# EAGLE design OSO-SAFE-A1-04 (EAGLE 9.4.2)
COMPANY: ADAFRUIT INDUSTRIES; DRAWN: KTOWN; REV: B
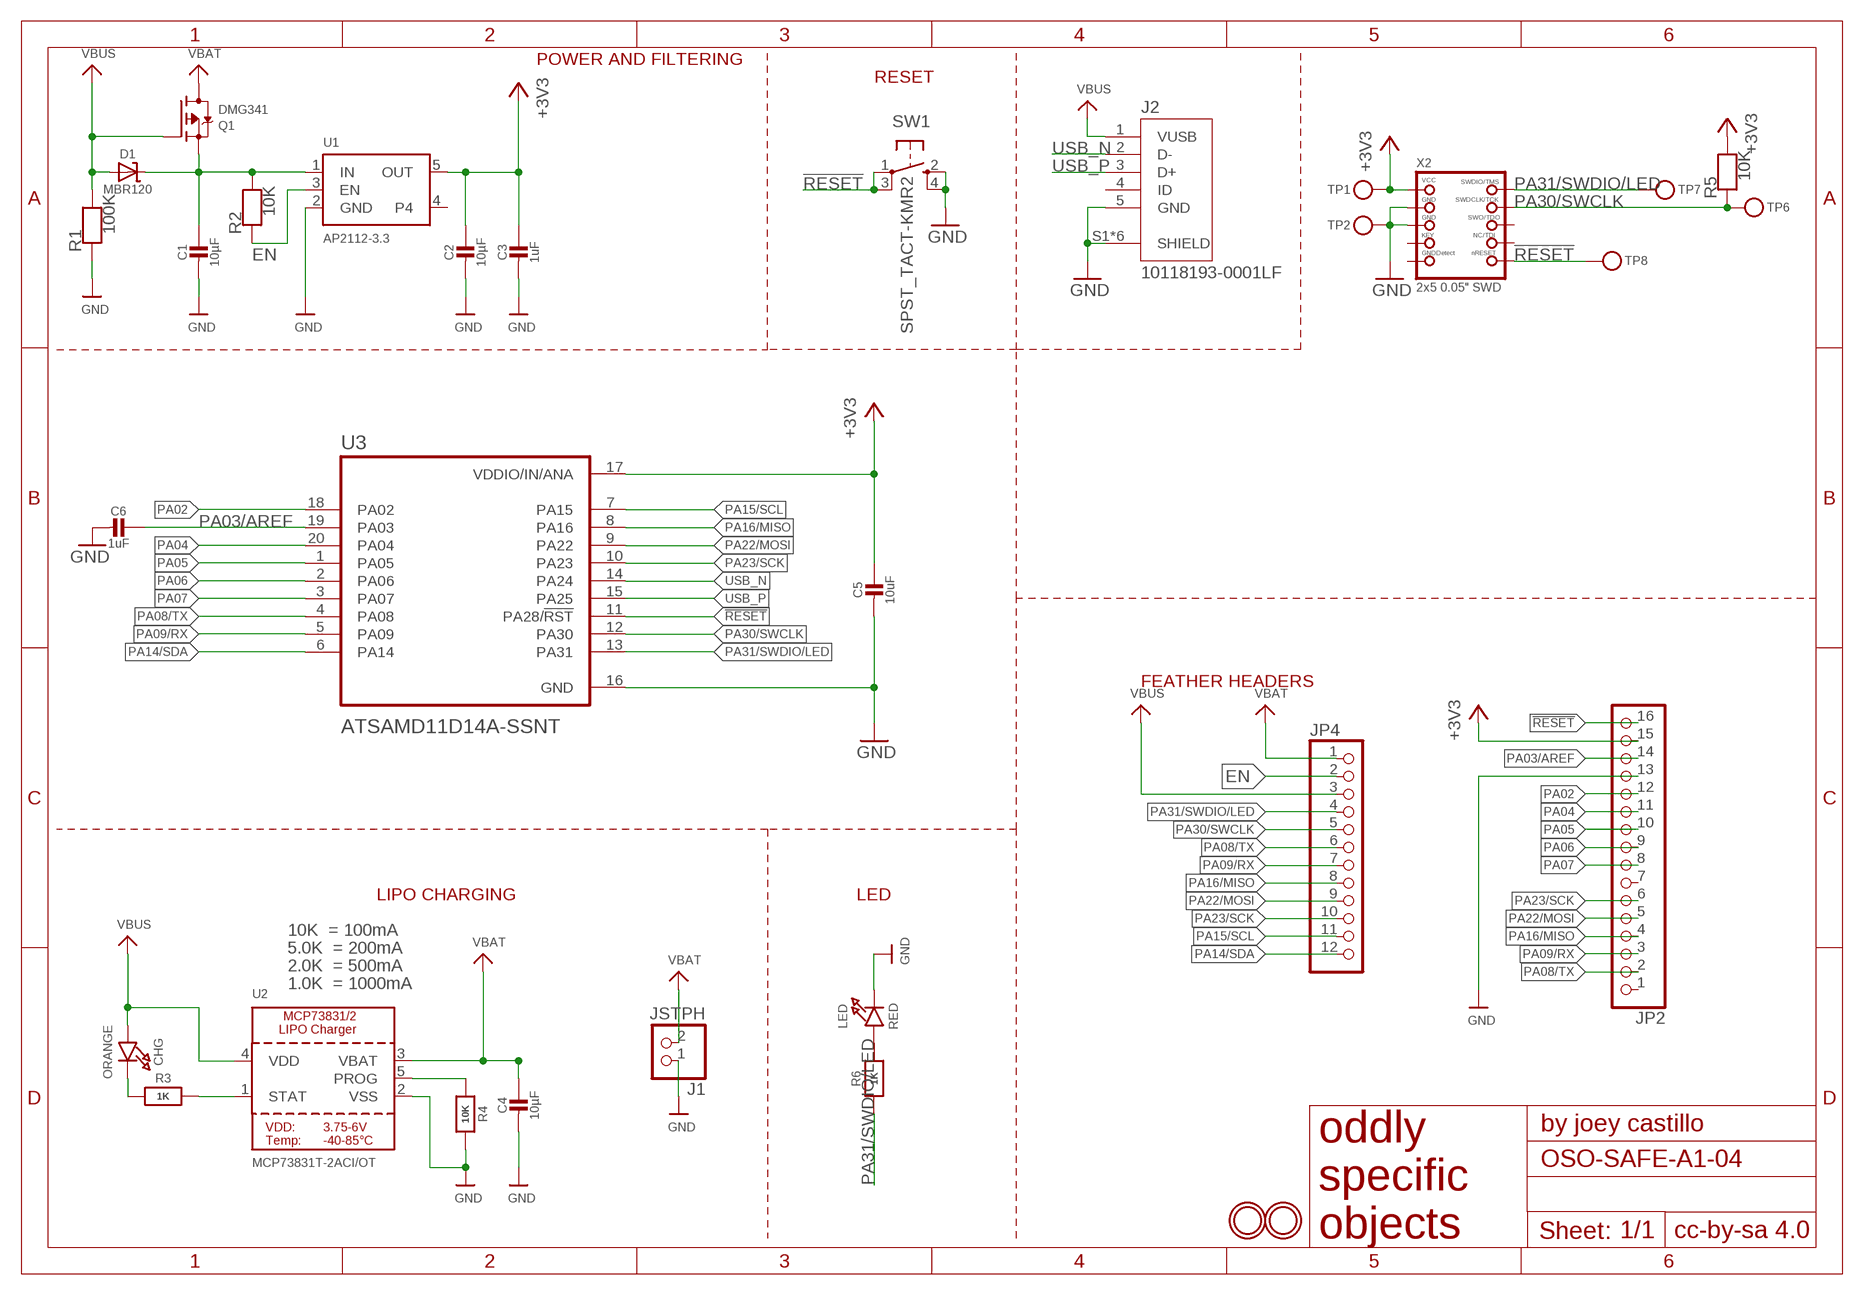
[diagram p0: schematic, sheet 1]

## Parts
C1  10µF  CAP_CERAMIC0805-NOOUTLINE  [0805-NO]
C2  10µF  CAP_CERAMIC0805-NOOUTLINE  [0805-NO]
C3  1uF  CAP_CERAMIC0805-NOOUTLINE  [0805-NO]
C4  10µF  CAP_CERAMIC0805-NOOUTLINE  [0805-NO]
C5  10uF  CAP_CERAMIC0805-NOOUTLINE  [0805-NO]
C6  1uF  CAP_CERAMIC0805-NOOUTLINE  [0805-NO]
CHG  ORANGE  LED0805_NOOUTLINE  [CHIPLED_0805_NOOUTLINE]
D1  MBR120  DIODE-SCHOTTKYSOD-123  [SOD-123]
J1  JSTPH  CON_JST_PH_2PIN  [JSTPH2]
J2  10118193-0001LF  [FCI_10118193-0001LF]
JP2  HEADER-1X16_MIN  [1X16_ROUND_MIN]
JP4  HEADER-1X12_MIN  [1X12_ROUND_MIN]
LED  RED  LED0805_NOOUTLINE  [CHIPLED_0805_NOOUTLINE]
Q1  DMG341  MOSFET-P  [SOT23-R]
R1  100K  RESISTOR0805_NOOUTLINE  [0805-NO]
R2  10K  RESISTOR0805_NOOUTLINE  [0805-NO]
R3  1K  RESISTOR0805_NOOUTLINE  [0805-NO]
R4  10K  RESISTOR0805_NOOUTLINE  [0805-NO]
R5  10K  RESISTOR0805_NOOUTLINE  [0805-NO]
R6  1K  RESISTOR0805_NOOUTLINE  [0805-NO]
SW1  SPST_TACT-KMR2  [KMR2]
TP1  TESTPOINTROUND2MMNO  [TESTPOINT_ROUND_2MM_NO]
TP2  TESTPOINTROUND2MMNO  [TESTPOINT_ROUND_2MM_NO]
TP6  TESTPOINTROUND2MMNO  [TESTPOINT_ROUND_2MM_NO]
TP7  TESTPOINTROUND2MMNO  [TESTPOINT_ROUND_2MM_NO]
TP8  TESTPOINTROUND2MMNO  [TESTPOINT_ROUND_2MM_NO]
U1  AP2112-3.3  VREG_SOT23-5  [SOT23-5]
U2  MCP73831T-2ACI/OT  MCP73831/2  [SOT23-5]
U3  ATSAMD11D14A-SSNT  [SOIC127P1030X265-20N]
U$31  MOUNTINGHOLE2.5  [MOUNTINGHOLE_2.5_PLATED]
U$32  MOUNTINGHOLE2.5  [MOUNTINGHOLE_2.5_PLATED]
X2  2x5 0.05" SWD  JTAG-CORTEXBOX  [2X05_1.27MM_BOX_NOPOSTS]

## Nets
!RESET: JP2.16 SW1.1(P) SW1.3(P1) TP8.P$1 U3.11(PA28/!RST) X2.10(NRESET)
+3V3 [power]: C2.1 C3.1 C5.1 JP2.15 R5.2 TP1.P$1 U1.5(OUT) U3.17(VDDIO/IN/ANA) X2.1(VCC)
CHG: CHG.C R3.1
EN: JP4.2 R2.1 U1.3(EN)
GND [gnd]: C1.2 C2.2 C3.2 C4.2 C5.2 C6.2 J1.1 J2.5(GND) J2.S1(SHIELD) J2.S2(SHIELD) J2.S3(SHIELD) J2.S4(SHIELD) J2.S5(SHIELD) J2.S6(SHIELD) JP2.13 LED.C R1.1 R4.2 SW1.2(S) SW1.4(S1) TP2.P$1 U1.2(GND) U2.2(VSS) U3.16(GND) X2.3(GND) X2.5(GND)
N$1: LED.A R6.2
PA02: JP2.12 U3.18(PA02)
PA03/AREF: C6.1 JP2.14 U3.19(PA03)
PA04: JP2.11 U3.20(PA04)
PA05: JP2.10 U3.1(PA05)
PA06: JP2.9 U3.2(PA06)
PA07: JP2.8 U3.3(PA07)
PA08/TX: JP2.2 JP4.6 U3.4(PA08)
PA09/RX: JP2.3 JP4.7 U3.5(PA09)
PA14/SDA: JP4.12 U3.6(PA14)
PA15/SCL: JP4.11 U3.7(PA15)
PA16/MISO: JP2.4 JP4.8 U3.8(PA16)
PA22/MOSI: JP2.5 JP4.9 U3.9(PA22)
PA23/SCK: JP2.6 JP4.10 U3.10(PA23)
PA30/SWCLK: JP4.5 R5.1 TP6.P$1 U3.12(PA30) X2.4(SWDCLK)
PA31/SWDIO/LED: JP4.4 R6.1 TP7.P$1 U3.13(PA31) X2.2(SWDIO)
PROG: R4.1 U2.5(PROG)
STAT: R3.2 U2.1(STAT)
USB_N: J2.2(D-) U3.14(PA24)
USB_P: J2.3(D+) U3.15(PA25)
VBAT [power]: C4.1 J1.2 JP4.1 Q1.3(D) U2.3(VBAT)
VBUS [power]: CHG.A D1.A J2.1(VUSB) JP4.3 Q1.1(G) R1.2 U2.4(VDD)
VHI [power]: C1.1 D1.C Q1.2(S) R2.2 U1.1(IN)
Unconnected: J2.4(ID) JP2.1 JP2.7 U1.4 X2.6(SWO) X2.7(KEY) X2.8(TDI) X2.9(GNDDETECT)

## Notes on the sheet
- POWER AND FILTERING
- RESET
- FEATHER HEADERS
- LIPO CHARGING | LED
- 10K  = 100mA
- 5.0K  = 200mA
- 2.0K  = 500mA
- 1.0K  = 1000mA

## Library data of the parts
C1-C6 = microbuilder:CAP_CERAMIC: Ceramic Capacitors For new designs, use the packages preceded by an '_' character since they are more reliable: The following footprints should be used on most boards: _0402 - Standard footprint for regular board layouts _0603 - Standard footprint for regular board layouts _0805 - Standard footprint for regular board layouts _1206 - Standard footprint for regular board layouts For extremely tight-pitch boards where space is at a premium, the following 'micro-pitch' footprints can be used (smaller pads, no silkscreen outline, etc.): _0402MP - Micro-pitch footprint for very dense/compact boards _0603MP - Micro-pitch footprint for very dense/compact boards _0805MP - Micro-pitch footprint for very dense/compact boards _1206MP - Micro-pitch footprint for very dense/compact boards
CHG LED = microbuilder:LED: LED 0603 - 0603 Surface Mount Package 2mA: Green LED - Low Power (3.9mcd, 2ma, 1.7Vf) - Digikey: 475-2709-2-ND Orange LED - Low Power (9.8mcd, 2ma, 1.8Vf) - Digikey: 475-1194-2-ND Red LED - Low Power (5mcd, 2ma, 1.8Vf) - Digikey: 475-1195-2-ND Yellow LED - Low Power (7mcd, 2ma, 1.8Vf) - Digikey: 475-1196-2-ND 5mA: Blue LED - Low Power (17mcd, 5ma, 2.9Vf) - Digikey: LNJ937W8CRACT-ND 0805 - 0805 Surface Mount Package 2mA: Red LED (8.8mcd, 2mA, 1.8Vf, Clear) - Low Power [Digikey: 475-2510-1-ND] Green LED (5mcd, 2mA, 1.8Vf, Clear) - Low Power [Digikey: 475-2730-1-ND] Yellow LED (11.3mcd, 2mA, 1.8Vf, Clear) - Low Power [Digikey: 475-2555-1-ND] 20mA: Red LED (104mcd, 20mA, Diffused) - LS R976 [Digikey: 475-1278-6-ND] Red LED (12mcd, 20mA, 2.0Vf, Clear) - APT2012EC [Digikey: 754-1128-1-ND] Green LED (15mcd, 20mA, 2.2Vf, Clear) - APT2012GC [Digikey: 754-1131-1-ND] Orange LED (160mcd, 20mA, 2.1Vf, Clear) - APT2012SECK [Digikey: 754-1130-1-ND] 1206 - 1206 Surface Mount Package Green LED (26mcd, 20mA, Diffused) - LG N971 [Digikey: 475-1407-6-ND] Red LED (15mcd, 20mA, Diffused) - LH N974 [Digikey: 475-1416-6-ND] Cree - Cree High-Power Surface Mount LEDs XPEBWT-L1-0000-00D50 - White 111lm 350mA 2.9Vf 6200K 110° XTEAWT-00-0000-00000LEE3 - White 114lm 350mA 2.85Vf 5000K 115° Everlight - Everlight 45-21 Series Surface Mount LEDs 45-21/QK2C-B2832AC2CB2/2T - Warm White 2000mcd 20mA 3.25Vf 3050K 120° 45-21/LK2C-B38452C4CB2/2T - Nuetral White 2000mcd 20mA 3.25Vf 4150K 120° 45-21/LK2C-B50634C6CB2/2T - Cold White 2200mcd 20mA 3.25Vf 5650K 120° PLCC2 Reverse Mount LS T77K-J1L2-1-0-2-R18-Z - Red 11.25mcd 2mA 1.8Vf 630nm 120° LO T77K-L1M2-24-Z - Orange 19.6mcd 2mA 1.8Vf 606nm 120° LY T77K-K2M1-26-Z - Yellow 15.7mcd 2mA 1.8Vf 587nm 120°
D1 = microbuilder:DIODE-SCHOTTKY
J1 = microbuilder:CON_JST_PH_2PIN: JST 2-Pin Right-Angle Connector PH-Series - 4UConnector: 17311 SH-Series - 4UConnector: 07278
J2 = 10118193-0001LF:10118193-0001LF: Micro USB B Type Receptacle; DESCRIPTION: Single Port 5 Contact Shielded SMT MICRO USB B-Type Receptacle; DIGI-KEY_PART_NUMBER: 609-4616-1-ND; DIGI-KEY_PURCHASE_URL: https://www.digikey.com/product-detail/en/amphenol-icc-fci/10118193-0001LF/609-4616-1-ND/2785380?utm_source=snapeda&utm_medium=aggregator&utm_campaign=symbol; MF: Amphenol ICC; MP: 10118193-0001LF; PACKAGE: None
JP2 = microbuilder:HEADER-1X16: PIN HEADER
JP4 = microbuilder:HEADER-1X12
Q1 = microbuilder:MOSFET-P: P-Channel Mosfet LEGEND VDS: Voltage Drain-Source ID: Drain Current RDS(ON): Drain-Source On-State Resistance VGS(TH): Gate-Source Threshold Voltage CISS: Drain-Source Input Capacitance SOT-23 Name VDS ID RDS(ON) VGS(TH) CISS Order Number IRLML5103 30V 760mA 600 mOhm -- 75pF @ 25V Digikey: IRLML5103PBFCT-ND IRLML6401 12V 4.3A 50 mOhm 950mV @ 250µA 830pF @ 10V Digikey: IRLML6401PBFTR-ND NTR0202PL 20V 400mA 800 mOhm 2.3V @ 250uA 70pF @ 5V Digikey: NTR0202PLT1GOSTR-ND NTR4101PT1G 20V 1.8A 85 mOhm 1.2V @ 250uA 675pF @ 10V Digikey: NTR4101PT1GOSCT-ND DMP2004K 20V 600mA 900 mOhm 1V @ 250uA 175pF @ 16V Digikey: DMP2004KDICT-ND PMV65XP 20V 3.9A 76 mOhm 950mV @ 1mA 725pF @ 20V Digikey: 568-2358-2-ND TO-252 Name VDS ID RDS(ON) VGS(TH) CISS Order Number AOD417 30V 25A 34 mOhm 3V @ 250µA 920pF @ 15V Digikey: 785-1106-2-ND PowerPak Name VDS ID RDS(ON) VGS(TH) CISS Order Number AON7401 30V 12A 14 mOhm 3V @ 250µA 2600pF @ 15V Digikey: 785-1302-1-ND
R1-R6 = microbuilder:RESISTOR: Resistors For new designs, use the packages preceded by an '_' character since they are more reliable: The following footprints should be used on most boards: _0402 - Standard footprint for regular board layouts _0603 - Standard footprint for regular board layouts _0805 - Standard footprint for regular board layouts _1206 - Standard footprint for regular board layouts For extremely tight-pitch boards where space is at a premium, the following 'micro-pitch' footprints can be used (smaller pads, no silkscreen outline, etc.): _0402MP - Micro-pitch footprint for very dense/compact boards _0603MP - Micro-pitch footprint for very dense/compact boards _0805MP - Micro-pitch footprint for very dense/compact boards _1206MP - Micro-pitch footprint for very dense/compact boards
SW1 = adafruit:SPST_TACT: SMT 6mm switch, EVQQ2 series http://www.ladyada.net/library/eagle
TP1 TP2 TP6-TP8 = microbuilder:TESTPOINT: Test Point Various test points for characterisation and PCB testing TESTPOINT_SMT - Compact Surface Mount Test Point [Digikey: 5016KTR-ND]
U1 = microbuilder:VREG_SOT23-5: SOT23-5 Fixed Voltage Regulators Part Current Out V Out V In V Dropout θJA (°C/W) TJ (°C) Digikey Part No. ADP121 150mA 3.3V 3.4-5.5V 0.09V @ 150mA -- -- ADP121-AUJZ33R7CT-ND ADP121 150mA 3.0V 3.1-5.5V 0.09V @ 150mA -- -- ADP121-AUJZ30R7CT-ND ADP122 300mA 3.3V 3.4-5.5V 0.085V @ 300mA -- -- ADP122AUJZ-3.3-R7CT-ND ADP1712 300mA 3.3V 3.5-5.5V 0.17V @ 300mA -- -- ADP1712AUJZ-3.3-R7TR-ND AP7311 (Low Cost) 150mA 3.3V 3.5-6V 0.15V @ 150mA -- -- AP7311-33WG-7DICT-ND LD39015M18R 150mA 1.8V 1.9V-5.5V 0.08V @ 100mA -- -- 497-6977-1-ND LP2985A-33DBVR 150mA 3.3V 3.3-16V 0.28V @ 150mA 206 150 296-18479-1-ND MCP1824T-3302E/OT 300mA 3.3V 3.5V-6V 0.2V @ 300mA -- -- MCP1824T-3302E/OTCT-ND MIC5205-2.5YM5 TR 150mA 2.5V 2.7-16V 0.165V @ 150mA -- -- 576-1257-2-ND MIC5205-3.0YM5 TR 150mA 3.0V 3.2V-16V 0.165V @ 150mA -- -- 576-1258-2-ND MIC5205-3.3YM5 TR 150mA 3.3V 3.5V-16V 0.165V @ 150mA -- -- 576-1259-2-ND TPS780330220 150mA 3.3V+2.2V 3.6-5.5V 250mV Max -- -- 296-23332-1-ND TDA3663/N1,135 100mA 3.3V 3.5-45V 0.18V @ 50mA -- -- 568-5343-1-ND Max operating temp can be calculated using θJA, TJ (max junction temperature), and power in watts. Set the "Maximum Ambient Temperature" until it reaches TJ ("Max Junction Temperature"), which is the absolute limit for safe use of the regulator: Heat Sink Temperature Calculator <http://www.daycounter.com/Calculators/Heat-Sink-Temperature-Calculator.phtml> For example, With 12V source into a 3.3V LP2985 and a 30mA load, we are dissipating (12V-3.3V) * 0.03A = 0.261W. With a θJA of 206 °C/W, a TJ of 150°C, and 261mW we can safely use the chip without a heat sink up to 75°C (=147.1°C Junction Temperature).
U2 = microbuilder:MCP73831/2: MCP73831/2 LIPO Charger VDD: 3.75 - 6V Temp -40 - 85°C Programmable Charge Rate: 15-500mA NOTE: STAT is a tri-state logic output on the MCP73831 and an open-drain output on the MCP73832. SOT23-5 with 4.2V output and tri-state logic on STAT = MCP73831T-2ACI/OT
U3 = ATSAMD11D14A-SSNT:ATSAMD11D14A-SSNT: None; AVAILABILITY: Unavailable; DESCRIPTION: Cortex-M0+, 16kb Flash, 4kb Sram, Usb - 20 Soic, 105c, Green, 1.6-3.6v, 48mhz, Usb/ Eiqj/Soic _s_; MF: Microchip; MP: ATSAMD11D14A-SSNT; PACKAGE: SOIC-20 Atmel; PRICE: None
U$31 U$32 = microbuilder:MOUNTINGHOLE: Mounting Hole For #2 screws (0.086"/2.18mm width, 0.094"/2.4mm hole) use 2.5mm; BOM: EXCLUDE
X2 = microbuilder:JTAG-CORTEX: Serial Wire (SW-DP) Connector Standard 0.05" 10-pin connector is for use with the Cortex M and Cortex A SWD (serial wire debugger) interface (SW-DP) Connectors 2x05_1.27MM_SMT - Inexpensive surface-mount header with bare pins, compatible with standard 10-pin SWD cables (4UCON: 16846) 2x05_1.27MM_BOX_NOPOSTS - Polarised surface-mount box (4UCON with caps: 19735, without caps: 15117 2x05_1.27MM_BOX_POSTS - Polarised surface-mount box with mounting holes (4UCON: 20317) Pinout: http://infocenter.arm.com/help/topic/com.arm.doc.faqs/attached/13634/cortex_debug_connectors.pdf http://www.keil.com/peripherals/coresight/connectors.asp

## Net classes
0 default: width 0.254 mm, drill 0.254 mm
1 power: width 0.305 mm, drill 0.305 mm
2 gnd: width 0.254 mm, drill 0.254 mm

## Board
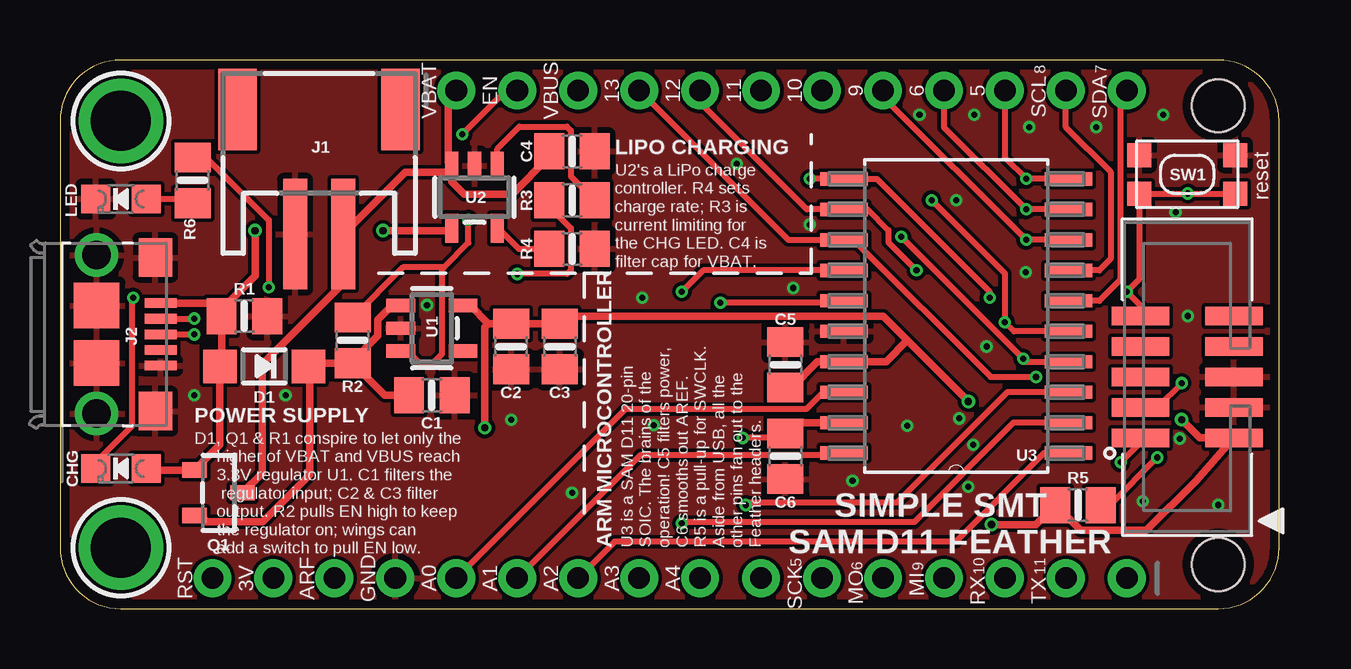
[diagram p1: board, top side]
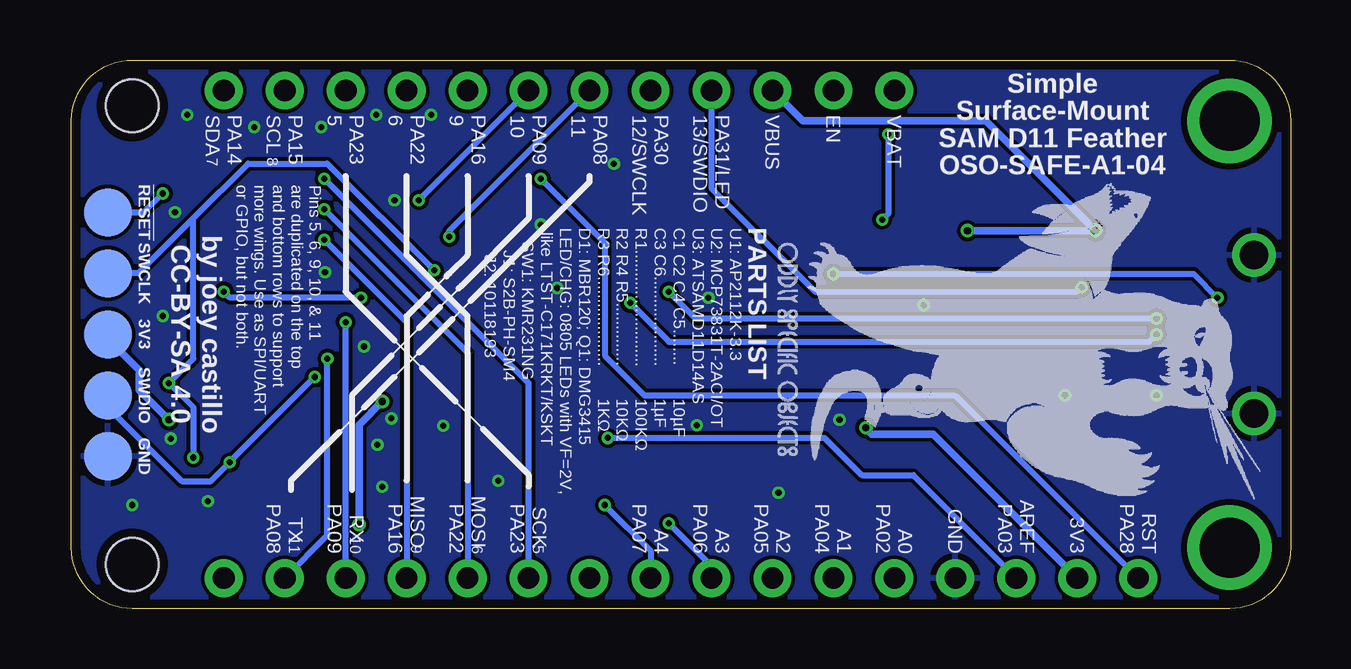
[diagram p2: board, bottom side, seen from below]

Size 50.8 x 22.86 mm. Coordinates in mm from the lower left corner, seen from the top.
Outline: 2.54,0 48.26,0 arc90 50.8,2.54 50.8,20.32 arc90 48.26,22.86 2.54,22.86 arc90 0,20.32 0,2.54 arc90 2.54,0
Copper layers (1*16): Top 0.035559375mm / dielectric 1.6mm / Bottom 0.035559375mm
Design rules "oshpark-2layer *": minimum track width 6mil, minimum drill 10mil, track to track 6mil, track to pad 6mil, pad to pad 6mil, via to via 6mil, smd to smd 6mil, copper to edge 15mil, drill to drill 6mil, minimum pad ring 5mil, minimum via ring 5mil, stop-mask expansion 2.5mil, vias tented up to drill 12mil, thermal gap 10mil
Holes 2.2 mm at 48.26,1.84 48.26,20.95

### Footprints (pad centres in the part's own frame; a part is rotated, then mirrored left to right if it is on the bottom)
0805-NO = smd 1.24 x 1.5: 1 -0.95,0; 2 0.95,0
CHIPLED_0805_NOOUTLINE = smd 1.2 x 1.2: A 0,-1.05; C 0,1.05
SOD-123 = smd 1.4 x 1.4: A 1.85,0; C -1.85,0
JSTPH2 = smd 1 x 4.6: 1 -1,-3.7; 2 1,-3.7 | smd 1.6 x 3.4: NC1 -3.4,1.5; NC2 3.4,1.5
FCI_10118193-0001LF = smd 0.4 x 1.35: 1 -1.3,2.675; 2 -0.65,2.675; 3 0,2.675; 4 0.65,2.675; 5 1.3,2.675 | smd 1.6 x 1.4: S1 -3.2,2.45; S2 3.2,2.45 | smd 1.9 x 1.9: S3 1.2,0; S4 -1.2,0 | drill 1.2: S5 3.302,0; S6 -3.302,0
1X16_ROUND_MIN = drill 0.9 pad 1.575: 1 -19.05,0; 2 -16.51,0; 3 -13.97,0; 4 -11.43,0; 5 -8.89,0; 6 -6.35,0; 7 -3.81,0; 8 -1.27,0; 9 1.27,0; 10 3.81,0; 11 6.35,0; 12 8.89,0; 13 11.43,0; 14 13.97,0; 15 16.51,0; 16 19.05,0
1X12_ROUND_MIN = drill 0.9 pad 1.575: 1 -13.97,0; 2 -11.43,0; 3 -8.89,0; 4 -6.35,0; 5 -3.81,0; 6 -1.27,0; 7 1.27,0; 8 3.81,0; 9 6.35,0; 10 8.89,0; 11 11.43,0; 12 13.97,0
SOT23-R = smd 0.635 x 1.016: 1 -0.95,-1; 2 0.95,-1; 3 0,1
KMR2 = smd 1 x 1: 1 2,0.8; 2 2,-0.8; 3 -2,0.8; 4 -2,-0.8
TESTPOINT_ROUND_2MM_NO = smd 2 x 2: P$1 0,0
SOT23-5 = smd 0.55 x 1.2: 1 -0.95,-1.3; 2 0,-1.3; 3 0.95,-1.3; 4 0.95,1.3; 5 -0.95,1.3
SOIC127P1030X265-20N = smd 1.981 x 0.559: 1 -4.674,5.715; 2 -4.674,4.445; 3 -4.674,3.175; 4 -4.674,1.905; 5 -4.674,0.635; 6 -4.674,-0.635; 7 -4.674,-1.905; 8 -4.674,-3.175; 9 -4.674,-4.445; 10 -4.674,-5.715; 11 4.674,-5.715; 12 4.674,-4.445; 13 4.674,-3.175; 14 4.674,-1.905; 15 4.674,-0.635; 16 4.674,0.635; 17 4.674,1.905; 18 4.674,3.175; 19 4.674,4.445; 20 4.674,5.715
MOUNTINGHOLE_2.5_PLATED = drill 2.5 pad 3.2: P$1 0,0
2X05_1.27MM_BOX_NOPOSTS = smd 0.76 x 2.4: 1 -2.54,-1.95; 2 -2.54,1.95; 3 -1.27,-1.95; 4 -1.27,1.95; 5 0,-1.95; 6 0,1.95; 7 1.27,-1.95; 8 1.27,1.95; 9 2.54,-1.95; 10 2.54,1.95

### Placement (x,y rotation side)
C1  15.49,8.89 0 top
C2  18.8,10.92 270 top
C3  20.83,10.92 270 top
C4  21.34,19.05 0 top
C5  30.23,10.16 90 top
C6  30.23,6.35 270 top
CHG  2.54,5.84 90 top
D1  8.51,10.1 180 top
J1  10.79,19.3 0 top
J2  1.52,11.43 270 top
JP2  25.4,1.27 180 top
JP4  30.48,21.59 0 top
LED  2.54,17.07 90 top
Q1  6.6,4.83 270 top
R1  7.68,12.19 180 top
R2  12.19,11.18 270 top
R3  21.34,17.02 0 top
R4  21.34,14.99 0 top
R5  42.42,4.32 180 top
R6  5.52,17.84 270 top
SW1  46.96,18.1 180 top
TP1  49.28,11.43 0 bottom
TP2  49.28,6.35 0 bottom
TP6  49.28,13.97 0 bottom
TP7  49.28,8.89 0 bottom
TP8  49.28,16.51 0 bottom
U1  15.49,11.68 270 top
U2  17.27,17.14 180 top
U3  37.34,12.19 180 top
U$6  [OSO_BEAR_525X750MIL_1000DPI]  10.67,11.18 270 bottom
U$9  [OSO_WORDMARK_ONELINE_350MIL_1000DPI]  20.95,10.79 270 bottom
U$31  2.54,20.32 270 top
U$32  2.54,2.54 270 top
X2  46.96,9.65 90 top

### Tracks (layer width: path | path; a pad name or v marks a point on that pad's centre or on a via)
!RESET  (via drill 0.25)
  Top 0.254: v31.24,17.91 U3.11 34.04,17.91 38.73,13.21 v38.73,12.95 | SW1.3 v46.99,17.3 SW1.1 44.97,13.72 v44.45,13.21 45.02,12.64 X2.10
  Bottom 0.254: v31.24,17.91 28.57,15.24 28.57,10.54 26.92,8.89 13.97,8.89 JP2.16 | v38.73,12.95 44.2,12.95 v44.45,13.21 | TP8.P$1 47.78,16.51 v46.99,17.3
+3V3  (via drill 0.3)
  Top 0.305: U1.5 17.08,12.63 17.85,11.87 | 17.85,11.87 C2.1 C3.1 21.03,11.87 21.34,12.18 34.3,12.18 35.31,11.18 | 17.85,11.87 17.7,11.72 v17.7,7.54 | 35.31,11.18 34.42,10.29 U3.17 31.56,10.29 30.48,9.21 C5.1 | v38.81,3.5 40.65,3.5 R5.2 42.52,3.26 45.27,3.26 47.34,5.33 X2.1 47.5,7.11 v46.74,7.87 | v37.85,8.64 35.31,11.18
  Bottom 0.305: JP2.15 14.88,7.26 17.45,7.26 17.7,7.52 v17.7,7.54 | v38.81,3.5 38.81,7.67 v37.85,8.64 | TP1.P$1 49.28,11.24 47.97,9.94 47.97,9.11 v46.74,7.87
CHG  (via drill 0.25)
  Top 0.254: R3.1 20.39,16.75 21.29,15.85 21.29,14.1 21.13,13.95 v19.05,13.95 | v3.05,12.95 3,12.9 3,7.6 1.49,6.1 CHG.C
  Bottom 0.254: v19.05,13.95 4.04,13.95 v3.05,12.95
EN  (via drill 0.25)
  Top 0.254: R2.1 14.29,14.22 16,14.22 | 16,14.22 17.02,15.24 v17.02,16.2 | 16,14.22 15.91,14.13 15.91,10.61 15.55,10.25 14.98,10.25 14.5,10.73 U1.3 | JP4.2 18.59,21.59 v16.76,19.76
  Bottom 0.254: v16.76,19.76 16.76,16.46 v17.02,16.2
GND  (via drill 0.25)
  other vias: 37.34,17.02 45.97,20.57 40.39,20.07 38.1,20.57 38.61,10.92 31.24,16 28.19,18.54 30.56,13.36 21.34,4.83 18.8,7.87 24.74,7.65 24.26,12.95 5.59,8.89 9.4,8.89 15.29,12.65 35.31,7.62 33.02,5.33 37.47,7.92 46.99,12.19 37.85,5.08 38.05,6.83 40.23,14.02 48.26,4.32 45.11,4.47 46.66,7.09 46.48,16.51 35.81,20.57 43.18,20.07
  pour Top: -0.25,22.86 -0.25,0 50.93,0 50.93,22.86
  pour Bottom: 0,0 51.18,0 51.18,22.86 0,22.86
N$1
  Top 0.254: LED.A 5.35,17.07 R6.2
PA02
  Top 0.254: U3.18 31.8,9.02 31.09,8.31 23.55,8.31 JP2.12
PA03/AREF  (via drill 0.25)
  Top 0.254: C6.1 30.16,7.3 29.97,7.11 v28.45,7.11
  Top 0.305: U3.19 30.67,7.75 C6.1
  Bottom 0.254: JP2.14 15.72,5.56 17.88,5.56 19.43,7.11 v28.45,7.11
PA04
  Top 0.254: U3.20 32.66,6.45 32.62,6.4 24.18,6.4 JP2.11
PA05
  Top 0.254: U3.1 41,6.48 37.31,2.79 23.11,2.79 JP2.10
PA06  (via drill 0.25)
  Top 0.254: v25.91,3.56 25.96,3.61 35.59,3.61 39.73,7.75 U3.2
  Bottom 0.254: v25.91,3.56 24.13,1.78 JP2.9
PA07  (via drill 0.25)
  Top 0.254: v28.57,4.32 28.68,4.42 34.87,4.42 39.47,9.02 U3.3
  Bottom 0.254: v28.57,4.32 26.67,2.41 JP2.8
PA08/TX  (via drill 0.25)
  Top 0.254: U3.4 40.26,10.29 v40.13,10.41 v35.05,15.49
  Bottom 0.254: JP2.2 40.13,3.05 v40.13,10.41 | v35.05,15.49 35.05,15.75 JP4.6
PA09/RX  (via drill 0.25)
  Top 0.254: U3.5 39.75,11.56 v39.37,11.94 39.37,13.97 v36.32,17.02
  Bottom 0.254: JP4.7 v36.32,17.02 | JP2.3 v39.37,11.94
PA14/SDA
  Top 0.254: JP4.12 44.45,21.56 44.19,21.29 44.19,13.71 43.31,12.83 U3.6
PA15/SCL
  Top 0.254: JP4.11 41.91,20.07 43.78,18.2 43.78,14.57 43.31,14.1 U3.7
PA16/MISO  (via drill 0.25)
  Top 0.254: U3.8 v40.26,15.37 34.29,21.34 JP4.8
  Bottom 0.254: v40.26,15.37 36.83,11.94 JP2.4
PA22/MOSI  (via drill 0.25)
  Top 0.254: U3.9 v40.26,16.64 36.83,20.07 JP4.9
  Bottom 0.254: v40.26,16.64 34.29,10.67 JP2.5
PA23/SCK  (via drill 0.25)
  Top 0.254: U3.10 v40.26,17.91 39.37,18.8 JP4.10
  Bottom 0.254: JP2.6 31.75,9.4 v40.26,17.91
PA30/SWCLK  (via drill 0.25)
  Top 0.254: JP4.5 26.67,21.08 31.11,16.64 U3.12 33.66,16.64 34.52,15.77 34.52,15.27 v35.69,14.1 | v46.74,9.4 45.72,8.38 X2.4 | v45.72,6.3 43.74,4.32 R5.1
  Bottom 0.254: v35.69,14.1 v35.69,14.09 40.14,18.54 43.43,18.54 45.72,16.26 | 45.72,16.26 45.72,10.41 v46.74,9.4 45.72,8.38 v45.72,6.3 | 45.72,16.26 48.01,13.97 TP6.P$1
PA31/SWDIO/LED  (via drill 0.25)
  Top 0.254: JP4.4 30.35,15.37 U3.13 33.06,15.37 38.77,9.65 v40.66,9.65 | R6.1 6.1,18.79 8.7,16.19 v8.7,13.39 | v44.2,6.1 45.21,7.11 X2.2
  Bottom 0.254: JP4.4 24.13,17.53 19.81,13.21 8.89,13.21 v8.7,13.39 | v40.66,9.65 44.2,6.12 v44.2,6.1 44.98,5.31 46.2,5.31 49.28,8.38 TP7.P$1
PROG
  Top 0.254: U2.5 18.26,15.85 19.12,14.99 R4.1
STAT
  Top 0.254: R3.2 21.29,18.02 21.29,19.92 21.12,20.08 19.14,20.08 18.22,19.16 U2.1
USB_N  (via drill 0.25)
  Top 0.254: v5.59,12.09 v5.58,12.08 J2.2 | U3.14 26.8,14.1 v25.91,13.21
  Bottom 0.254: v5.59,12.09 24.79,12.09 v25.91,13.21
USB_P  (via drill 0.25)
  Top 0.254: v5.59,11.43 v5.58,11.43 J2.3 | U3.15 32.58,12.74 v27.52,12.74
  Bottom 0.254: v5.59,11.43 5.89,11.12 25.9,11.12 v27.52,12.74
VBAT
  Top 0.305: U2.3 16.07,18.19 14.38,18.19 J1.2 11.79,13.55 8.43,10.18 8.43,5.65 Q1.3 | U2.3 16.17,18.6 16.17,21.25 JP4.1 | U2.3 16.32,17.79 16.84,17.27 18.84,17.27 20.39,18.82 C4.1
VBUS  (via drill 0.3)
  Top 0.305: v8.13,15.75 8.13,13.87 6.99,12.73 J2.1 6.2,12.73 R1.2 6.73,10.17 D1.A 6.66,6.83 Q1.1 3.66,5.78 CHG.A | v13.46,15.75 16.23,15.75 U2.4
  Bottom 0.305: JP4.3 20.32,20.32 12.7,20.32 v8.13,15.75 v13.46,15.75
VHI
  Top 0.305: C1.1 13.53,8.89 R2.2 | R2.2 10.49,10.23 D1.C 10.41,10.04 10.41,5.59 8.45,3.62 6.11,3.62 5.86,3.88 Q1.2 | U1.1 14.08,12.52 13.72,12.52 13.25,12.04 13.25,11.37 12.19,10.31 R2.2

### Text on the board
tPlace: VBAT | EN | VBUS | 13 | 12 | 11 | 10 | 9 | 6 | 5 | 8 | 7 | SCL | SDA | LIPO CHARGING | U2's a LiPo charge / controller. R4 sets / charge rate; R3 is / current limiting for / the CHG LED. C4 is / filter cap for VBAT. | reset | POWER SUPPLY | D1, Q1 & R1 conspire to let only the / higher of VBAT and VBUS reach / 3.3V regulator U1. C1 filters the / regulator input; C2 & C3 filter / output. R2 pulls EN high to keep / the regulator on; wings can / add a switch to pull EN low. | SIMPLE SMT / SAM D11 FEATHER | ARM MICROCONTROLLER | U3 is a SAM D11 20-pin / SOIC. The brains of the / operation! C5 filters power, / C6 smooths out AREF. / R5 is a pull-up for SWCLK. / Aside from USB, all the / other pins fan out to the / Feather headers. | 5 | 6 | 9 | 10 | 11 | RST | 3V | ARF | GND | A0 | A1 | A2 | A3 | A4 | SCK | MO | MI | RX | TX
bPlace: VBAT | EN | VBUS | PA31/LED / 13/SWDIO | PA30 / 12/SWCLK | PA08 / 11 | PA09 / 10 | PA16 / 9 | PA22 / 6 | PA23 / 5 | PA15 / SCL | PA14 / SDA | Simple / Surface-Mount / SAM D11 Feather / OSO-SAFE-A1-04 | 8 | 7 | Pins 5, 6, 9, 10, & 11 / are duplicated on the top / and bottom rows to support / more wings. Use as SPI/UART / or GPIO, but not both. | !RESET | PARTS LIST | U1: AP2112K-3.3 / U2: MCP73831T-2ACI/OT / U3: ATSAMD11D14AS / C1 C2 C4 C5........ / C3 C6.................... / R1.......................... / R2 R4 R5.............. / R3 R6.................... / D1: MBR120; Q1: DMG3415 / LED/CHG: 0805 LEDs with VF=2V, / like LTST-C171KRKT/KSKT / SW1: KMR231NG / J1: S2B-PH-SM4 / J2: 10118193 | SWCLK | by joey castillo / CC-BY-SA 4.0 | 3V3 | 10µF / 1µF / 100KΩ / 10KΩ / 1KΩ | SWDIO | GND | RST / PA28 | 3V3 | AREF / PA03 | GND | A0 / PA02 | A1 / PA04 | A2 / PA05 | A3 / PA06 | A4 / PA07 | 5 | SCK / PA23 | 6 | MOSI / PA22 | 9 | MISO / PA16 | 10 | RX / PA09 | 11 | TX / PA08
tNames: SW1